# Altium schematic sheet Easyino_Cosimo.schdoc
size 273 x 171 mm
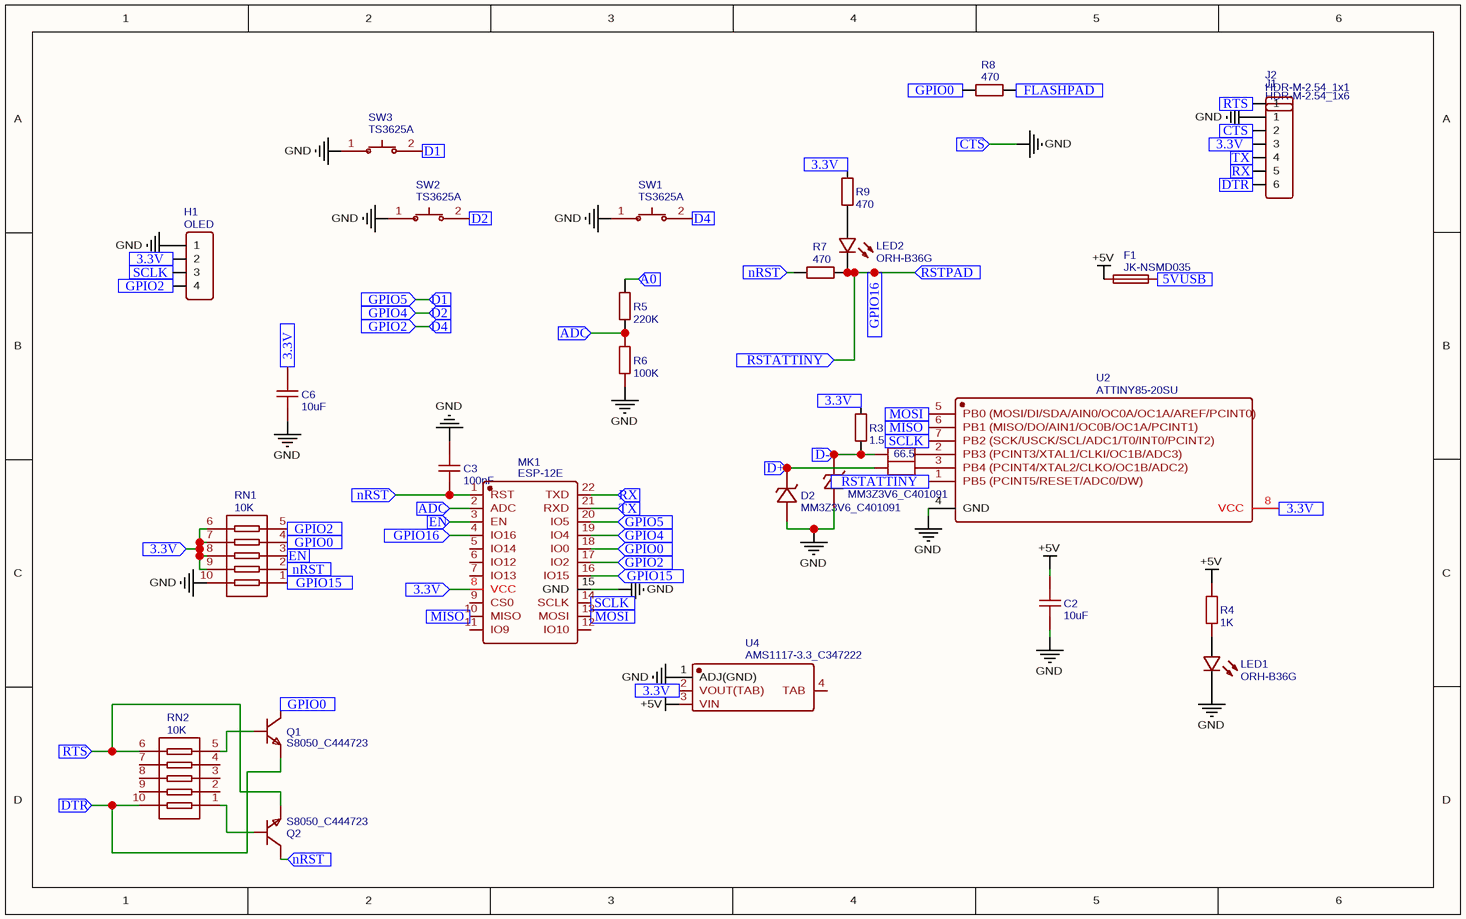
[diagram p0: Easyino_Cosimo.schdoc]

## Parts
C2  10uF  [C0603]
C3  100nF  [C0402]
C6  10uF  [C0603]
D1  MM3Z3V6_C401091  [SOD-323_L1.8-W1.3-LS2.5-RD]
D2  MM3Z3V6_C401091  [SOD-323_L1.8-W1.3-LS2.5-RD]
F1  JK-NSMD035  [F1206]
H1  OLED  [HDR-F-2.54_1X4]
J1  HDR-M-2.54_1x6  [HDR-M-2.54_1X6]
J2  HDR-M-2.54_1x1  [HDR-M-2.54_1X1]
LED1  ORH-B36G  [LED0603-R-RD]
LED2  ORH-B36G  [LED0603-R-RD]
MK1  ESP-12E  [WIFIM-SMD_ESP-12E]
Q1  S8050_C444723  [SOT-23_L2.9-W1.3-P0.95-LS2.4-BR]
Q2  S8050_C444723  [SOT-23_L2.9-W1.3-P0.95-LS2.4-BR]
R1  66.5  [R0402]
R2  66.5  [R0402]
R3  1.5K  [R0402]
R4  1K  [R0402]
R5  220K  [R0402]
R6  100K  [R0402]
R7  470  [R0402]
R8  470  [R0402]
R9  470  [R0402]
RN1  10K  [RES-ARRAY-SMD_0603-10P-L3.2-W1.6-BL]
RN2  10K  [RES-ARRAY-SMD_0603-10P-L3.2-W1.6-BL]
SW1  TS3625A  [KEY-SMD_L6.0-W3.5-LS8.4]
SW2  TS3625A  [KEY-SMD_L6.0-W3.5-LS8.4]
SW3  TS3625A  [KEY-SMD_L6.0-W3.5-LS8.4]
U2  ATTINY85-20SU  [SOIC-8_L5.3-W5.3-P1.27-LS8.0-BL]
U4  AMS1117-3.3_C347222  [SOT-223_L6.7-W3.5-P2.30-BR]

## Ports
3.3V (in), 5VUSB (in), A0 (in), ADC (in), CTS (in), D1 (in), D2 (in), D4 (in), D+ (in), D- (in), DTR (in), EN (in), FLASHPAD (in), GPIO0 (in), GPIO2 (in), GPIO4 (in), GPIO5 (in), GPIO15 (in), GPIO16 (in), MISO (in), MOSI (in), nRST (in), RSTATTINY (in), RSTPAD (in), RTS (in), RX (in), SCLK (in), TX (in)

## Nets
+5V: C2.1 F1.1 R4.1 U4.3(VIN)
GND: C2.2 C3.2 C6.2 D1.2(A) D2.2(A) H1.1 J1.1 J1.2 LED1.2(C) MK1.15(GND) R6.1 RN1.10 SW1.1 SW2.1 SW3.1 U2.4(GND) U4.1(ADJ(GND)) ; port CTS
3.3V: C6.1 H1.2 J1.3 MK1.8(VCC) R3.2 R9.2 RN1.6 RN1.7 RN1.8 RN1.9 U2.8(VCC) U4.2(VOUT(TAB)) ; port 3.3V
5VUSB: F1.2 ; port 5VUSB
A0: R5.2 ; port A0
ADC: MK1.2(ADC) R5.1 R6.2 ; port ADC
D1: MK1.20(IO5) SW3.2 ; port GPIO5, port D1
D2: MK1.19(IO4) SW2.2 ; port GPIO4, port D2
D4: H1.4 MK1.17(IO2) RN1.5 SW1.2 ; port GPIO2, port D4
D+: D2.1(K) R1.1 ; port D+
D-: D1.1(K) R2.1 R3.1 ; port D-
DTR: J1.6 Q1.2(E) RN2.10 ; port DTR
EN: MK1.3(EN) RN1.3 ; port EN
FLASHPAD: R8.2 ; port FLASHPAD
GPIO0: MK1.18(IO0) Q1.3(C) R8.1 RN1.4 ; port GPIO0
GPIO15: MK1.16(IO15) RN1.1 ; port GPIO15
GPIO16: LED2.2(C) MK1.4(IO16) R7.2 U2.1(PB5_(PCINT5/RESET/ADC0/DW)) ; port RSTATTINY, port RSTPAD, port GPIO16
MISO: MK1.10(MISO) U2.6(PB1_(MISO/DO/AIN1/OC0B/OC1A/PCINT1)) ; port MISO
MOSI: MK1.13(MOSI) U2.5(PB0_(MOSI/DI/SDA/AIN0/OC0A/OC1A/AREF/PCINT0)) ; port MOSI
nRST: C3.1 MK1.1(RST) Q2.3(C) R7.1 RN1.2 ; port nRST
RTS: J2.1 Q2.2(E) RN2.6 ; port RTS
RX: J1.5 MK1.22(TXD) ; port RX
SCLK: H1.3 MK1.14(SCLK) U2.7(PB2_(SCK/USCK/SCL/ADC1/T0/INT0/PCINT2)) ; port SCLK
TX: J1.4 MK1.21(RXD) ; port TX
NetLED1_1: LED1.1(A) R4.2
NetLED2_1: LED2.1(A) R9.1
NetQ1_1: Q1.1(B) RN2.5
NetQ2_1: Q2.1(B) RN2.1
NetR1_2: R1.2 U2.3(PB4_(PCINT4/XTAL2/CLKO/OC1B/ADC2))
NetR2_2: R2.2 U2.2(PB3_(PCINT3/XTAL1/CLKI/OC1B/ADC3))

Not connected (* = marked no-connect by the designer): MK1 5(IO14) 6(IO12) 7(IO13) 9(CS0) 11(IO9) 12(IO10); RN2 2 3 4 7 8 9; U4 4(TAB)

## Library data of the parts
C2 C6 = 10uF: BOM_Manufacturer: SAMSUNG; BOM_Manufacturer Part: CL10A106MQ8NNNC; nameAlias: Capacitance; BOM_Supplier: LCSC; BOM_Supplier Part: C1691; spicePre: C; spiceSymbolName: CL10A106MQ8NNNC
C3 = 100nF: BOM_Manufacturer: WTC; BOM_Manufacturer Part: 0402B104K160; nameAlias: Capacitance; BOM_Supplier: LCSC; BOM_Supplier Part: C83056; spicePre: C; spiceSymbolName: 0402B104K160
D1 D2 = MM3Z3V6_C401091: BOM_Manufacturer: Shandong Jingdao Microelectronics; Contributor: LCSC; BOM_Supplier: LCSC; BOM_Supplier Part: C401091; BOM_Manufacturer Part: MM3Z3V6; spicePre: D; spiceSymbolName: MM3Z3V6_C401091
F1 = JK-NSMD035: BOM_Manufacturer: Jinrui Electronic Materials Co.; Contributor: LCSC; BOM_Supplier: LCSC; BOM_Supplier Part: C369158; BOM_Manufacturer Part: JK-NSMD035; spicePre: F; spiceSymbolName: JK-NSMD035
H1 = OLED: Contributor: LCEDA_Lib; BOM_Supplier Part: C225501; BOM_Supplier: LCSC; spicePre: H; spiceSymbolName: HDR-F-2.54_1x4
J1 = HDR-M-2.54_1x6: Contributor: LCEDA_Lib; BOM_Supplier Part: C190819; BOM_Supplier: LCSC; spicePre: J; spiceSymbolName: HDR-M-2.54_1x6
J2 = HDR-M-2.54_1x1: Contributor: LCEDA_Lib; BOM_Supplier Part: C81276; BOM_Supplier: LCSC; spicePre: J; spiceSymbolName: HDR-M-2.54_1x1
LED1 LED2 = ORH-B36G: BOM_Manufacturer: Orient; Contributor: LCSC; SMT Type: Extend; BOM_Supplier: LCSC; BOM_Supplier Part: C193191; BOM_Manufacturer Part: ORH-B36G; BOM_JLCPCB SMD: Yes; spicePre: L; spiceSymbolName: ORH-B36G
MK1 = ESP-12E: BOM_Manufacturer: Ai-Thinker; BOM_Supplier: LCSC; BOM_Manufacturer Part: ESP-12E; BOM_Supplier Part: C89297; spicePre: M; spiceSymbolName: ESP-12E
Q1 Q2 = S8050_C444723: BOM_Manufacturer: Slkor(SLKORMICRO Elec.); BOM_Manufacturer Part: S8050; Contributor: LCSC; BOM_Supplier: LCSC; BOM_Supplier Part: C444723; spicePre: Q; spiceSymbolName: S8050_C444723
R1 R2 = 66.5: BOM_Manufacturer: Uniroyal Elec; BOM_Manufacturer Part: 0402WGF665JTCE; nameAlias: Resistance (Ohms); Contributor: LCSC; BOM_Supplier: LCSC; BOM_Supplier Part: C423141; spicePre: R; spiceSymbolName: 0402WGF665JTCE
R3 = 1.5K: BOM_Manufacturer: UniOhm; BOM_Manufacturer Part: 0402WGJ0152TCE; nameAlias: Resistance (Ohms); BOM_Supplier: LCSC; BOM_Supplier Part: C25930; spicePre: R; spiceSymbolName: 0402WGJ0152TCE
R4 = 1K: BOM_Manufacturer: Guangdong Fenghua Advanced Tech; BOM_Manufacturer Part: RC-02W102JT; nameAlias: Resistance (Ohms); Contributor: LCSC; BOM_Supplier: LCSC; BOM_Supplier Part: C258117; spicePre: R; spiceSymbolName: RC-02W102JT
R5 = 220K: BOM_Manufacturer: FH; BOM_Manufacturer Part: RS-02K2203FT; nameAlias: Resistance (Ohms); BOM_Supplier: LCSC; BOM_Supplier Part: C140181; spicePre: R; spiceSymbolName: RS-02K2203FT
R6 = 100K: BOM_Manufacturer: Guangdong Fenghua Advanced Tech; BOM_Manufacturer Part: RC-02W1003FT; nameAlias: Resistance (Ohms); Contributor: LCSC; BOM_Supplier: LCSC; BOM_Supplier Part: C258090; spicePre: R; spiceSymbolName: RC-02W1003FT
R7-R9 = 470: BOM_Manufacturer: UniOhm; BOM_Manufacturer Part: 0402WGJ0471TCE; nameAlias: Resistance (Ohms); BOM_Supplier: LCSC; BOM_Supplier Part: C25167; spicePre: R; spiceSymbolName: 0402WGJ0471TCE
RN1 RN2 = 10K: BOM_Manufacturer: YAGEO; BOM_Manufacturer Part: YC158TJR-0710KL; nameAlias: Resistance (Ohms); Contributor: LCSC; BOM_Supplier: LCSC; BOM_Supplier Part: C309679; spicePre: R; spiceSymbolName: YC158TJR-0710KL
SW1-SW3 = TS3625A: BOM_Manufacturer: SHOU HAN; Contributor: LCSC; BOM_Supplier: LCSC; BOM_Supplier Part: C398053; BOM_Manufacturer Part: TS3625A; spicePre: S; spiceSymbolName: TS3625A
U2 = ATTINY85-20SU: BOM_Manufacturer: MICROCHIP; SMT Type: Extend; BOM_Supplier: LCSC; BOM_Manufacturer Part: ATTINY85-20SU; BOM_Supplier Part: C89852; BOM_JLCPCB SMD: Yes; spicePre: U; spiceSymbolName: ATTINY85-20SU
U4 = AMS1117-3.3_C347222: BOM_Manufacturer: Youtai Semiconductor Co., Ltd.; Contributor: LCSC; SMT Type: Extend; BOM_Supplier: LCSC; BOM_Supplier Part: C347222; BOM_Manufacturer Part: AMS1117-3.3; BOM_JLCPCB SMD: Yes; spicePre: U; spiceSymbolName: AMS1117-3.3_C347222